# Altium project 按键_数码管v2.PrjPcb
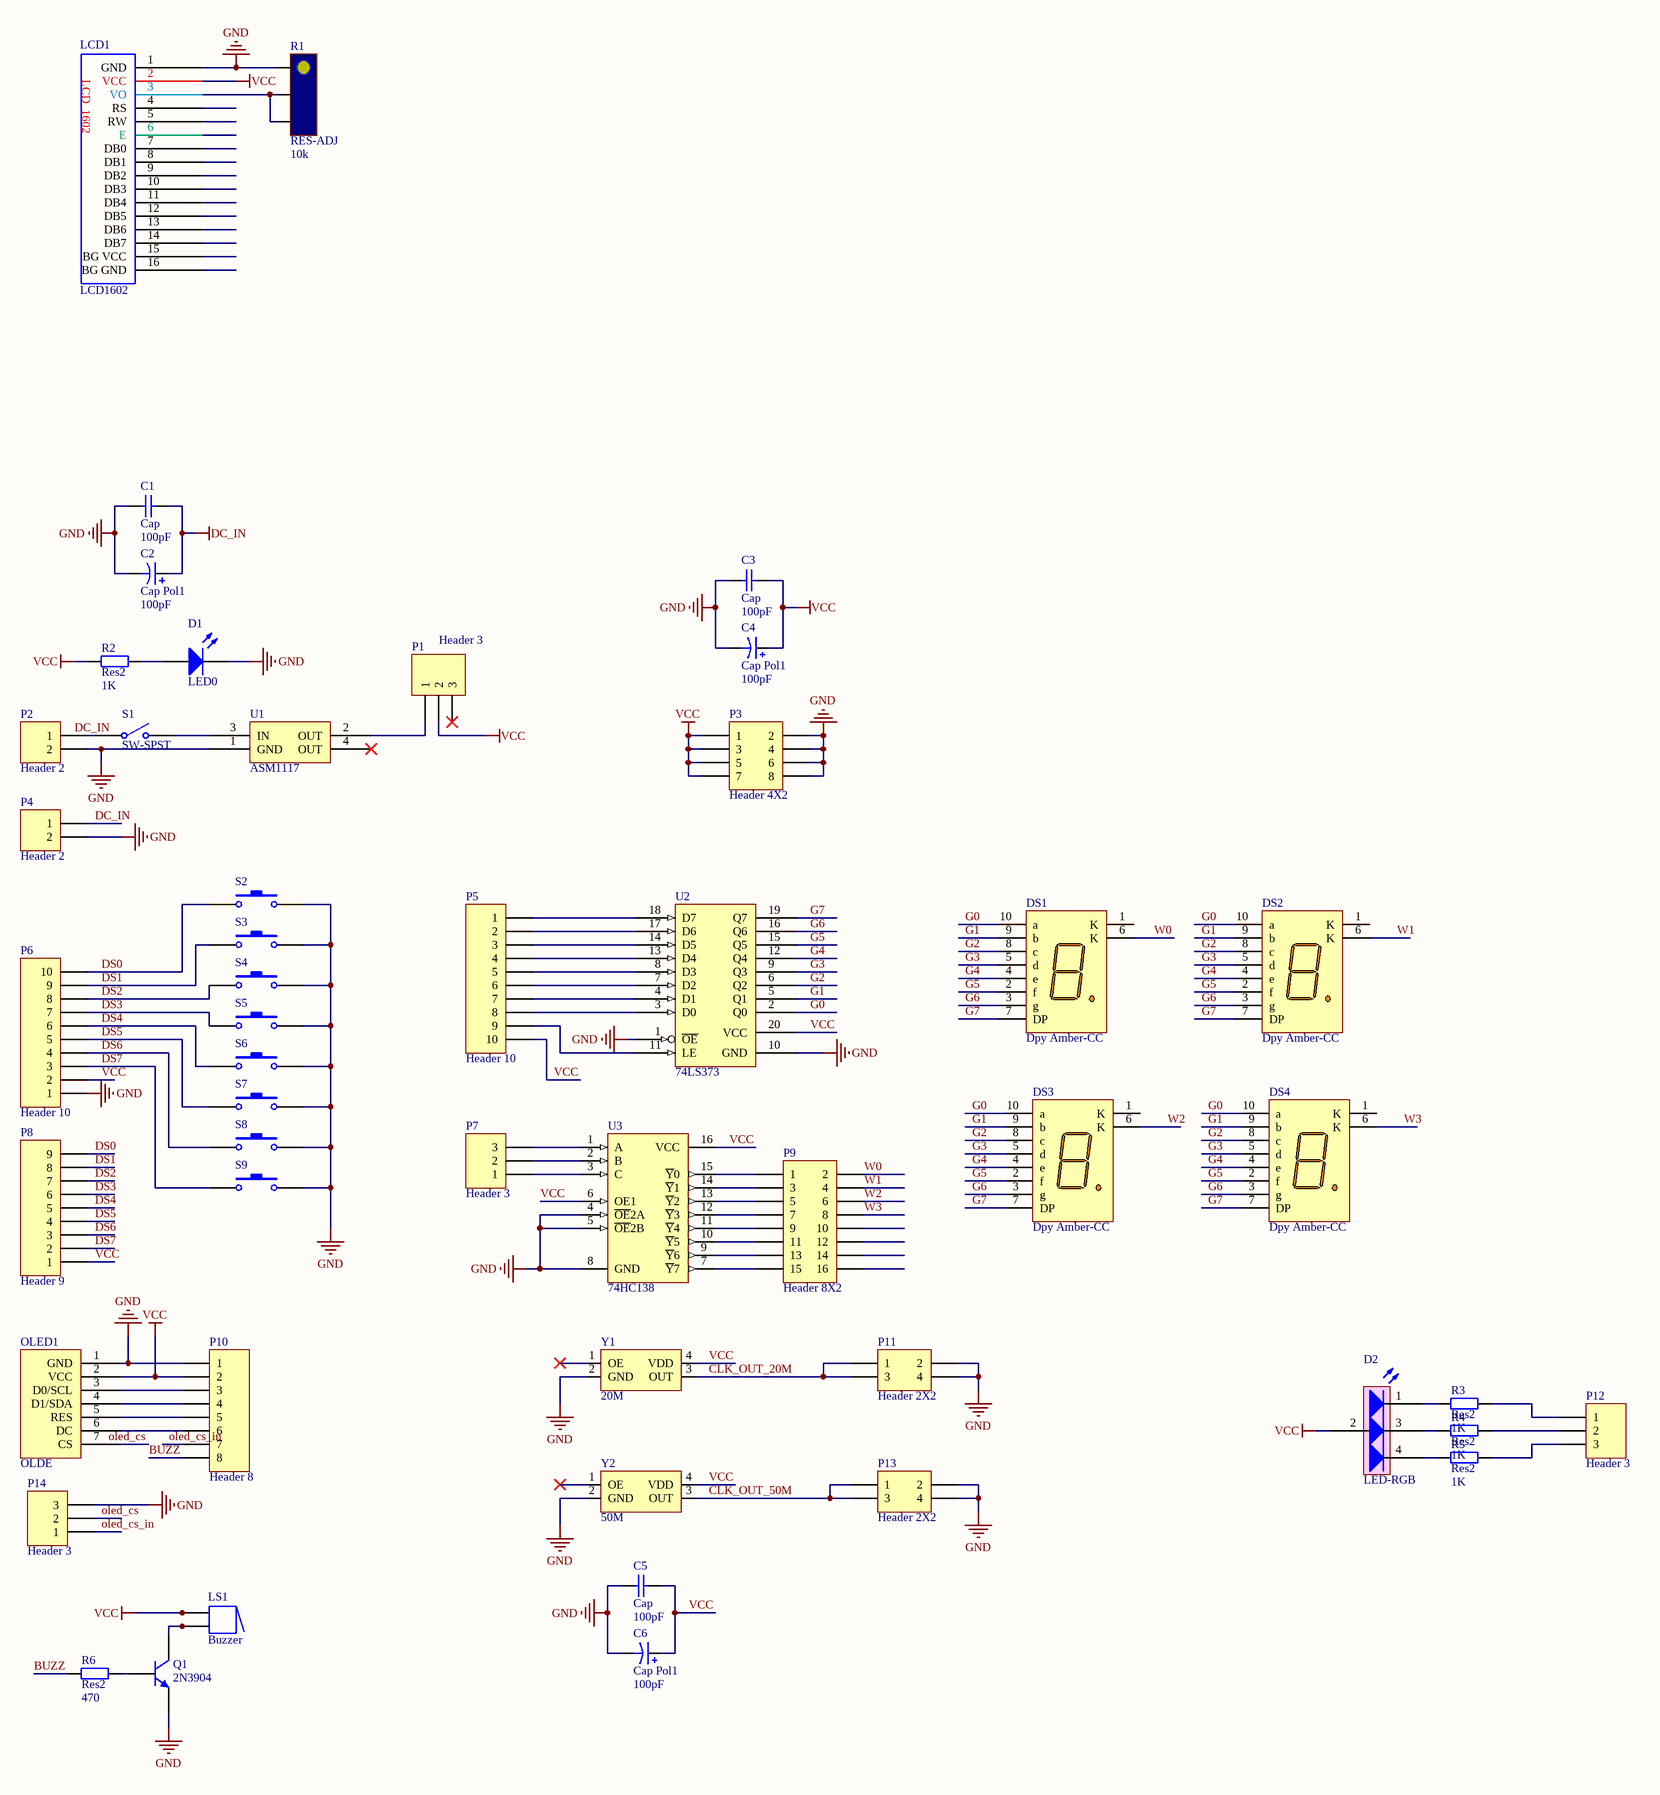
[diagram p0: 按键_数码管.SchDoc]
1 sheet, 50 parts. Net scope: global (net labels, ports and power ports of the same name join across sheets).
Board file: 按键_数码管.PcbDoc

## Sheet 按键_数码管.SchDoc
size A2

### Parts
C1  Cap  value 100pF  [C-0805]
C2  Cap Pol1  value 100pF  [C-RB-8]
C3  Cap  value 100pF  [C-0805]
C4  Cap Pol1  value 100pF  [C-RB-8]
C5  Cap  value 100pF  [C-0805]
C6  Cap Pol1  value 100pF  [C-RB-8]
D1  LED0  [LED]
D2  LED-RGB  [LED-RGB]
DS1  Dpy Amber-CC  [A]
DS2  Dpy Amber-CC  [A]
DS3  Dpy Amber-CC  [A]
DS4  Dpy Amber-CC  [A]
LCD1  LCD1602  [1602LCD]
LS1  Buzzer  [Beep]
OLED1  OLDE  [HDR1X7]
P1  Header 3  [HDR1X3]
P2  Header 2  [USB_B1]
P3  Header 4X2  [HDR2X4]
P4  Header 2  [USB_B1]
P5  Header 10  [HDR1X10]
P6  Header 10  [HDR1X10]
P7  Header 3  [HDR1X3]
P8  Header 9  [HDR1X9]
P9  Header 8X2  [HDR2X8]
P10  Header 8  [HDR1X8]
P11  Header 2X2  [HDR2X2]
P12  Header 3  [HDR1X3]
P13  Header 2X2  [HDR2X2]
P14  Header 3  [HDR1X3]
Q1  2N3904  [SOT-23]
R1  RES-ADJ  value 10k
R2  Res2  value 1K  [0805]
R3  Res2  value 1K  [0805]
R4  Res2  value 1K  [0805]
R5  Res2  value 1K  [0805]
R6  Res2  value 470  [0805]
S1  SW-SPST  [SW-6pin]
S2  SW-PB  [KeyA]  (value not drawn)
S3  SW-PB  [KeyA]  (value not drawn)
S4  SW-PB  [KeyA]  (value not drawn)
S5  SW-PB  [KeyA]  (value not drawn)
S6  SW-PB  [KeyA]  (value not drawn)
S7  SW-PB  [KeyA]  (value not drawn)
S8  SW-PB  [KeyA]  (value not drawn)
S9  SW-PB  [KeyA]  (value not drawn)
U1  ASM1117  [SOT-223]
U2  74LS373  [DIP20]
U3  74HC138  [DIP16]
Y1  value 20M  [XTAL-OCX7050 - M]  (hidden comment: XATLS)
Y2  value 50M  [XTAL-OCX7050 - M]  (hidden comment: XATLS)

### Nets
DC_IN: C1.2 C2.1 P4.1
GND: C1.1 C2.2 C3.1 C4.2 C5.1 C6.2 D1.2(K) LCD1.1(GND) OLED1.1(GND) P2.2 P3.2 P3.4 P3.6 P3.8 P4.2 P6.1 P10.1 P11.2 P11.4 P13.2 P13.4 P14.3 Q1.1(E) R1.3 S2.2 S3.2 S4.2 S5.2 S6.2 S7.2 S8.2 S9.2 U1.1(GND) U2.1(~{OE}) U2.10(GND) U3.4(~{OE}2A) U3.5(~{OE}2B) U3.8(GND) Y1.2(GND) Y2.2(GND)
VCC: C3.2 C4.1 C5.2 C6.1 D2.2(A) LCD1.2(VCC) LS1.1 LS1.1A OLED1.2(VCC) P1.2 P3.1 P3.3 P3.5 P3.7 P5.10 P6.2 P8.1 P10.2 R2.1 U2.20(VCC) U3.6(OE1) U3.16(VCC) Y1.4(VDD) Y2.4(VDD)
BUZZ: P10.8 R6.1
CLK_OUT_20M: P11.1 P11.3 Y1.3(OUT)
CLK_OUT_50M: P13.1 P13.3 Y2.3(OUT)
DS0: P6.10 P8.9 S2.1
DS1: P6.9 P8.8 S3.1
DS2: P6.8 P8.7 S4.1
DS3: P6.7 P8.6 S5.1
DS4: P6.6 P8.5 S6.1
DS5: P6.5 P8.4 S7.1
DS6: P6.4 P8.3 S8.1
DS7: P6.3 P8.2 S9.1
G0: DS1.10(a) DS2.10(a) DS3.10(a) DS4.10(a) U2.2(Q0)
G1: DS1.9(b) DS2.9(b) DS3.9(b) DS4.9(b) U2.5(Q1)
G2: DS1.8(c) DS2.8(c) DS3.8(c) DS4.8(c) U2.6(Q2)
G3: DS1.5(d) DS2.5(d) DS3.5(d) DS4.5(d) U2.9(Q3)
G4: DS1.4(e) DS2.4(e) DS3.4(e) DS4.4(e) U2.12(Q4)
G5: DS1.2(f) DS2.2(f) DS3.2(f) DS4.2(f) U2.15(Q5)
G6: DS1.3(g) DS2.3(g) DS3.3(g) DS4.3(g) U2.16(Q6)
G7: DS1.7(DP) DS2.7(DP) DS3.7(DP) DS4.7(DP) U2.19(Q7)
oled_cs: P14.2
oled_cs_in: P10.7 P14.1
W0: DS1.6(K) P9.2
W1: DS2.6(K) P9.4
W2: DS3.6(K) P9.6
W3: DS4.6(K) P9.8
NetD1_1: D1.1(A) R2.2
NetD2_1: D2.1(R) R3.1
NetD2_3: D2.3(G) R4.1
NetD2_4: D2.4(B) R5.1
NetLCD1_3: LCD1.3(VO) R1.1 R1.2
NetLS1_2: LS1.2 LS1.2A Q1.3(C)
NetOLED1_3: OLED1.3(D0/SCL) P10.3
NetOLED1_4: OLED1.4(D1/SDA) P10.4
NetOLED1_5: OLED1.5(RES) P10.5
NetOLED1_6: OLED1.6(DC) P10.6
NetP1_1: P1.1 U1.2(OUT)
NetP2_1: P2.1 S1.1(COMMON)
NetP5_1: P5.1 U2.18(D7)
NetP5_2: P5.2 U2.17(D6)
NetP5_3: P5.3 U2.14(D5)
NetP5_4: P5.4 U2.13(D4)
NetP5_5: P5.5 U2.8(D3)
NetP5_6: P5.6 U2.7(D2)
NetP5_7: P5.7 U2.4(D1)
NetP5_8: P5.8 U2.3(D0)
NetP5_9: P5.9 U2.11(LE)
NetP7_1: P7.1 U3.3(C)
NetP7_2: P7.2 U3.2(B)
NetP7_3: P7.3 U3.1(A)
NetP9_1: P9.1 U3.15(~{Y}0)
NetP9_3: P9.3 U3.14(~{Y}1)
NetP9_5: P9.5 U3.13(~{Y}2)
NetP9_7: P9.7 U3.12(~{Y}3)
NetP9_9: P9.9 U3.11(~{Y}4)
NetP9_11: P9.11 U3.10(~{Y}5)
NetP9_13: P9.13 U3.9(~{Y}6)
NetP9_15: P9.15 U3.7(~{Y}7)
NetP12_1: P12.1 R3.2
NetP12_2: P12.2 R4.2
NetP12_3: P12.3 R5.2
NetQ1_2: Q1.2(B) R6.2
NetS1_2: S1.2(NO) U1.3(IN)

Not connected (* = marked no-connect by the designer): DS1 1(K); DS2 1(K); DS3 1(K); DS4 1(K); LCD1 4(RS) 5(RW) 6(E) 7(DB0) 8(DB1) 9(DB2) 10(DB3) 11(DB4) 12(DB5) 13(DB6) 14(DB7) 15(BG_VCC) 16(BG_GND); OLED1 7(CS); P1 3*; P9 10 12 14 16; U1 4(OUT)*; Y1 1(OE)*; Y2 1(OE)*

### Notes on the sheet
- Labels drawn without touching a wire or pin: DC_IN, oled_cs
- (in symbol LCD1602) LCD  1602

### Library data of the parts
C1 C3 C5 = Cap: Capacitor; Published: 8-Jun-2000; LatestRevisionDate: 17-Jul-2002; LatestRevisionNote: Re-released for DXP Platform.; PackageReference: RAD-0.3; Publisher: Altium Limited; PackageDescription: Radial Cap, Thru-Hole; 2 Leads; 0.3 in Pin Spacing
C2 C4 C6 = Cap Pol1: Polarized Capacitor (Radial); Published: 8-Jun-2000; LatestRevisionDate: 17-Jul-2002; LatestRevisionNote: Re-released for DXP Platform.; PackageReference: RB7.6-15; Publisher: Altium Limited; PackageDescription: Polarized Capacitor (Radial); 2 Leads
D1 = LED0: Typical INFRARED GaAs LED; Published: 8-Jun-2000; LatestRevisionDate: 08-Jul-2005; LatestRevisionNote: Mech Layer 1 removed.; PackageReference: LED-0; Publisher: Altium Limited; PackageDescription: LED; 2 Leads
D2 = LED-RGB: 三基色LED; Published: 8-Jun-2000; LatestRevisionDate: 08-Jul-2005; LatestRevisionNote: Mech Layer 1 removed.; PackageReference: LED-0; Publisher: Altium Limited
DS1-DS4 = Dpy Amber-CC: 7.62 mm Black Surface Orange 7-Segment Display: CC, RH DP; MinimumIntensity: 354 ucd; Note: IF = 5 mA; Note: Pins 1 and 6 are redundant Cathodes.; Published: 8-Jun-2000; LatestRevisionDate: 17-Dec-2003; LatestRevisionNote: Schematic revised, PCB Footprint replaced.; DatasheetVersion: 19-Feb-2002; PackageVersion: 11-Feb-2002; PackageReference: A; Publisher: Altium Limited; PackageDescription: LED, 7-Segment Display, 7.62 mm, RHD; 10 Leads; Row Space 5.08 mm; Pitch 2.54 mm; Colour: Orange; ComponentLink1Description: Manufacturer Link; ComponentLink1URL: http://www.agilent.com/
LS1 = Buzzer: Magnetic Transducer Buzzer; Published: 24-Mar-1999; LatestRevisionDate: 17-Dec-2003; LatestRevisionNote: Schematic revised, PCB Footprint replaced.; DatasheetVersion: 17-Dec-2003; PackageReference: ABSM-1574; Publisher: Altium Limited; PackageDescription: Magnetic Transducer Buzzer; ComponentLink1Description: Manufacturer Link; ComponentLink1URL: http://www.megastar.com/linecard/buzzmode/index.php
OLED1 = OLED-0.96寸
P1 P7 P12 P14 = Header 3: Header, 3-Pin; LatestRevisionDate: 17-Jul-2002; LatestRevisionNote: Re-released for DXP Platform.; Publisher: Altium Limited
P2 P4 = Header 2: Header, 2-Pin; LatestRevisionDate: 17-Jul-2002; LatestRevisionNote: Re-released for DXP Platform.; Publisher: Altium Limited
P3 = Header 4X2: Header, 4-Pin, Dual row; LatestRevisionDate: 17-Jul-2002; LatestRevisionNote: Re-released for DXP Platform.; Publisher: Altium Limited
P5 P6 = Header 10: Header, 10-Pin; LatestRevisionDate: 17-Jul-2002; LatestRevisionNote: Re-released for DXP Platform.; Publisher: Altium Limited
P8 = Header 9: Header, 9-Pin; LatestRevisionDate: 17-Jul-2002; LatestRevisionNote: Re-released for DXP Platform.; Publisher: Altium Limited
P9 = Header 8X2: Header, 8-Pin, Dual row; LatestRevisionDate: 17-Jul-2002; LatestRevisionNote: Re-released for DXP Platform.; Publisher: Altium Limited
P10 = Header 8: Header, 8-Pin; LatestRevisionDate: 17-Jul-2002; LatestRevisionNote: Re-released for DXP Platform.; Publisher: Altium Limited
P11 P13 = Header 2X2: Header, 2-Pin, Dual row; LatestRevisionDate: 17-Jul-2002; LatestRevisionNote: Re-released for DXP Platform.; Publisher: Altium Limited
Q1 = 2N3904: NPN General Purpose Amplifier; Published: 8-Jun-2000; LatestRevisionDate: 15-Jan-2003; LatestRevisionNote: PCB Footprint 'BCY-W3/D4.7' replaced; DatasheetVersion: 1997; PackageVersion: Sep-1998; PackageReference: TO-92A; Publisher: Altium Limited; PackageDescription: TO, Flat Index; 3 In-Line, Axial Leads; Body Dia. 4.5mm; Leads 0.51 x 0.48 mm (max); ComponentLink1Description: Manufacturer Link; ComponentLink1URL: http://www.fairchildsemi.com/; ComponentLink2Description: Datasheet; ComponentLink2URL: http://www.fairchildsemi.com/ds/2N%2F2N3904.pdf
R2-R6 = Res2: Resistor; Published: 8-Jun-2000; LatestRevisionDate: 17-Jul-2002; LatestRevisionNote: Re-released for DXP Platform.; PackageReference: AXIAL-0.4; Publisher: Altium Limited; PackageDescription: Axial Device, Thru-Hole; 2 Leads; 0.4 in Pin Spacing
S1 = SW-SPST: Single-Pole, Single-Throw Switch; Published: 24-Mar-1999; LatestRevisionDate: 17-Jul-2002; LatestRevisionNote: Re-released for DXP Platform.; PackageReference: SPST-2; Publisher: Altium Limited; PackageDescription: Switch; 2 Leads
S2-S9 = SW-PB: Switch; Published: 24-Mar-1999; LatestRevisionDate: 17-Jul-2002; LatestRevisionNote: Re-released for DXP Platform.; PackageReference: SPST-2; Publisher: Altium Limited; PackageDescription: Switch; 2 Leads
U1 = ASM1117: 3.3V稳压芯片
U3 = 74HC138: 138译码器; Published: 17-Jul-2002; LatestRevisionDate: 13-Apr-2006; LatestRevisionNote: IPC-7351 Footprint Added.; DatasheetVersion: Nov-1999; PackageVersion: 2000; PackageReference: M16D; Publisher: Altium Limited; PackageDescription: 16-Pin Small Outline Package 1.27 mm Pitch; ComponentLink1Description: Manufacturer Link; ComponentLink1URL: http://www.fairchildsemi.com/; ComponentLink2Description: Datasheet; ComponentLink2URL: http://www.fairchildsemi.com/ds/74%2F74AC138.pdf
Y1 Y2 = XATLS: 贴片有源晶振